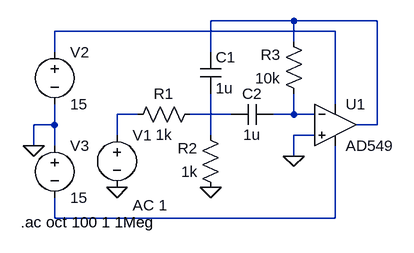
[diagram p0: schematic MultipleFeedbackBPF.asc]
MultipleFeedbackBPF.asc, the LTspice schematic file:
Version 4
SHEET 1 880 680
WIRE 288 16 160 16
WIRE 416 16 288 16
WIRE 352 32 -80 32
WIRE 288 48 288 16
WIRE -80 64 -80 32
WIRE 160 64 160 16
WIRE 352 144 352 32
WIRE 48 160 16 160
WIRE 192 160 128 160
WIRE 288 160 288 128
WIRE 288 160 256 160
WIRE 320 160 288 160
WIRE -80 176 -80 144
WIRE -80 176 -112 176
WIRE 416 176 416 16
WIRE 416 176 384 176
WIRE 16 192 16 160
WIRE 160 192 160 128
WIRE 320 192 288 192
WIRE -112 208 -112 176
WIRE -80 208 -80 176
WIRE 288 224 288 192
WIRE -80 320 -80 288
WIRE 352 320 352 208
WIRE 352 320 -80 320
FLAG 16 272 0
FLAG 160 272 0
FLAG 288 224 0
FLAG -112 208 0
SYMBOL Opamps\\AD549 352 112 R0
SYMATTR InstName U1
SYMBOL res 144 144 R90
WINDOW 0 0 56 VBottom 2
WINDOW 3 32 56 VTop 2
SYMATTR InstName R1
SYMATTR Value 1k
SYMBOL res 176 288 R180
WINDOW 0 36 76 Left 2
WINDOW 3 36 40 Left 2
SYMATTR InstName R2
SYMATTR Value 1k
SYMBOL res 304 144 R180
WINDOW 0 36 76 Left 2
WINDOW 3 36 40 Left 2
SYMATTR InstName R3
SYMATTR Value 10k
SYMBOL cap 144 64 R0
SYMATTR InstName C1
SYMATTR Value 1u
SYMBOL cap 256 144 R90
WINDOW 0 0 32 VBottom 2
WINDOW 3 32 32 VTop 2
SYMATTR InstName C2
SYMATTR Value 1u
SYMBOL voltage 16 176 R0
WINDOW 123 24 124 Left 2
WINDOW 39 0 0 Left 0
SYMATTR InstName V1
SYMATTR Value ""
SYMATTR Value2 AC 1
SYMBOL voltage -80 48 R0
WINDOW 123 0 0 Left 0
WINDOW 39 0 0 Left 0
SYMATTR InstName V2
SYMATTR Value 15
SYMBOL voltage -80 192 R0
WINDOW 123 0 0 Left 0
WINDOW 39 0 0 Left 0
SYMATTR InstName V3
SYMATTR Value 15
TEXT -132 326 Left 2 !.ac oct 100 1 1Meg

The netlist it stands for:
* MultipleFeedbackBPF.asc
XU1 0 N005 N002 N007 N001 AD549  ; pins In+ In- V+ V- OUT
R1 N004 N003 1k
R2 0 N006 1k
R3 N005 N001 10k
C1 N001 N006 1u
C2 N005 N004 1u
V1 N003 0 AC 1
V2 N002 0 15
V3 0 N007 15
.ac oct 100 1 1Meg
.backanno
.end